# Altium schematic sheet Exemplo_1.SchDoc
size A4
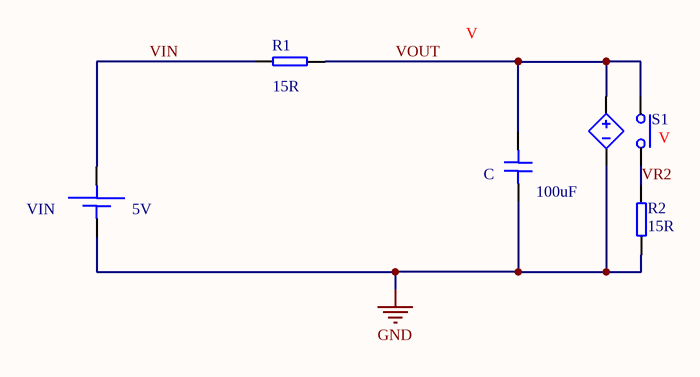
[diagram p0: Exemplo_1.SchDoc]

## Parts
C  100uF
R1  value 15R  (hidden comment: 10K 1/8W)
R2  value 15R  (hidden comment: 10K 1/8W)
S1  VCSW  (value not drawn)  (no BOM)
VIN  5V  (no BOM)

## Nets
GND: C.2 R2.1 S1.2 VIN.2
VIN: R1.1 VIN.1
VOUT: C.1 R1.2 S1.1 S1.3
VR2: R2.2 S1.4

## Library data of the parts
C = CAP 10uF 50V SMD 0805: CERAMIC CAPACITOR 10uF 50V 5% -55C TO 125C SMD 0805; PART NUMBERS: Daagno Altium Library/Components; CODE: 010-000000-00; ORDERING PARAMETERS: 10uF 5% 50V -55C TO 125C; INITIAL VOLTAGE: 0V; ASSEMBLY: SMD; STATUS: PROTOTYPE; CATEGORY: CAPACITOR; VALUE: 100uF; SHORT DESCRIPTION: 10uF 50V
R1 R2 = RES 10K 1/8W SMD 0805: CHIP RESISTOR 10K 1/8W 5% -55C TO 125C SMD 0805; PART NUMBERS: Daagno Altium Library/Components; CODE: 010-000000-00; ORDERING PARAMETERS: 10K 5% 1/8W -55C TO 125C; ASSEMBLY: SMD; STATUS: PROTOTYPE; CATEGORY: RESISTOR; SHORT DESCRIPTION: 10K 1/8W
S1 = VOLTAGE CONTROLLED SWITCH: GENERIC VOLTAGE CONTROLLED SWITCH FOR SIMULATION; ASSEMBLY: NONE; SHORT DESCRIPTION: VC SWITCH; CODE: NONE; PART NUMBERS: NONE; STATUS: SIMULATION; CATEGORY: SWITCH; FOOTPRINT: NONE; ORDERING PARAMETERS: NONE; VALUE: VCSW
VIN = DC SOURCE: GENERIC DC SOURCE FOR SIMULATION; ASSEMBLY: NONE; AC MAGNITUDE: 0; Time-Value Pairs: 0 0 100u 0 100u 5 10 5; CODE: NONE; PART NUMBERS: NONE; STATUS: SIMULATION; CATEGORY: POWER SUPPLY; FOOTPRINT: NONE; VALUE: 5V; SHORT DESCRIPTION: DC SOURCE; ORDERING PARAMETERS: NONE; AC PHASE: 0